# Altium schematic sheet TI_SCH.SchDoc
size 1651 x 1651 mm
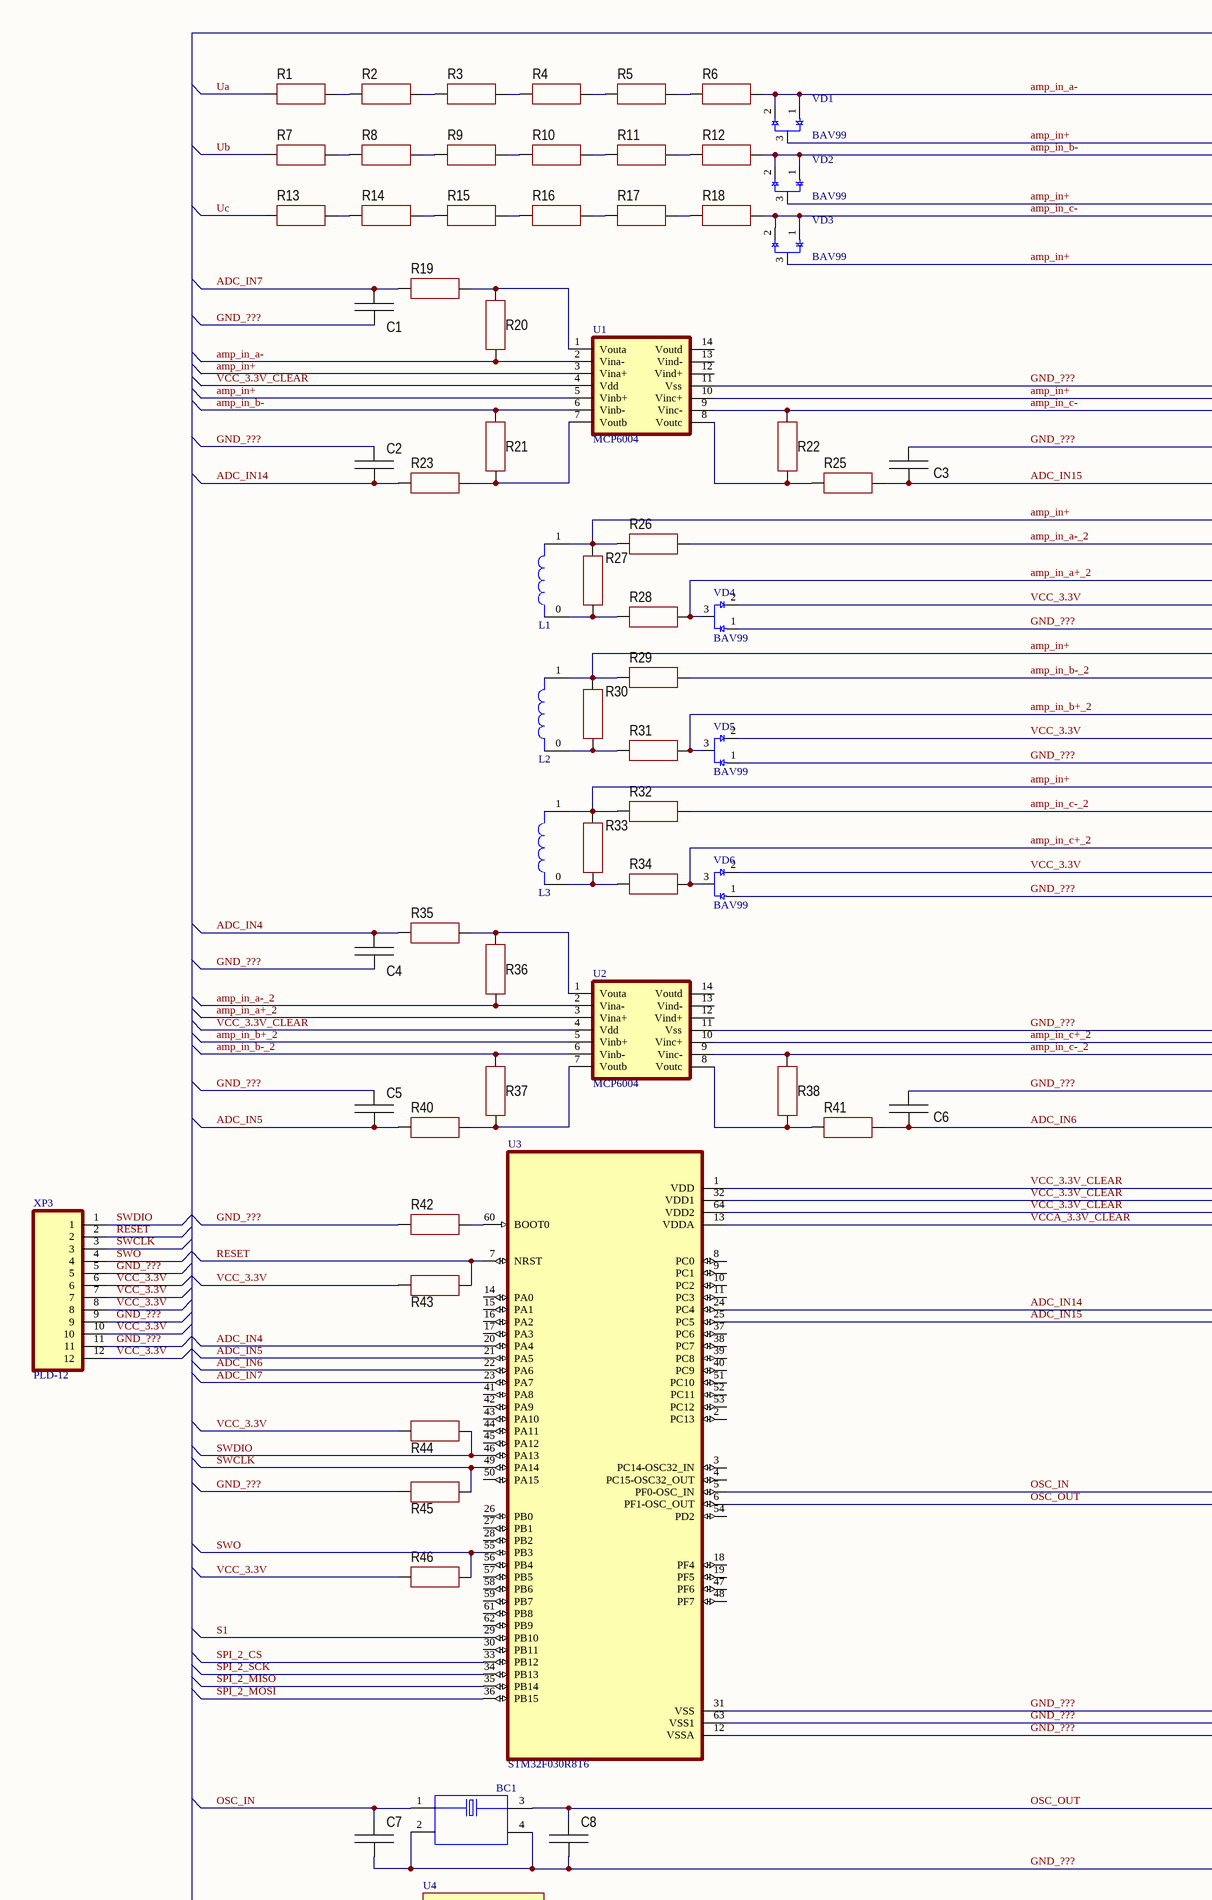
[diagram p0: TI_SCH.SchDoc, row 1 of 4 left]
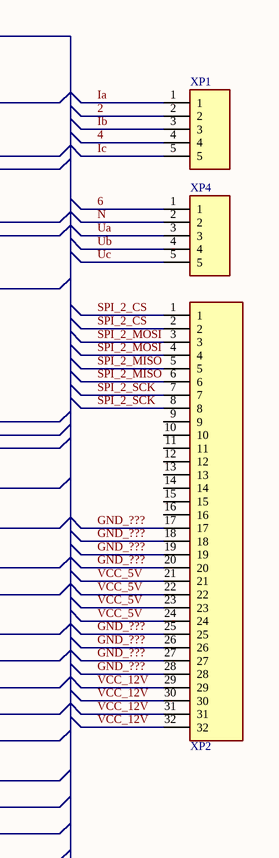
[diagram p1: TI_SCH.SchDoc, row 1 of 4 right]
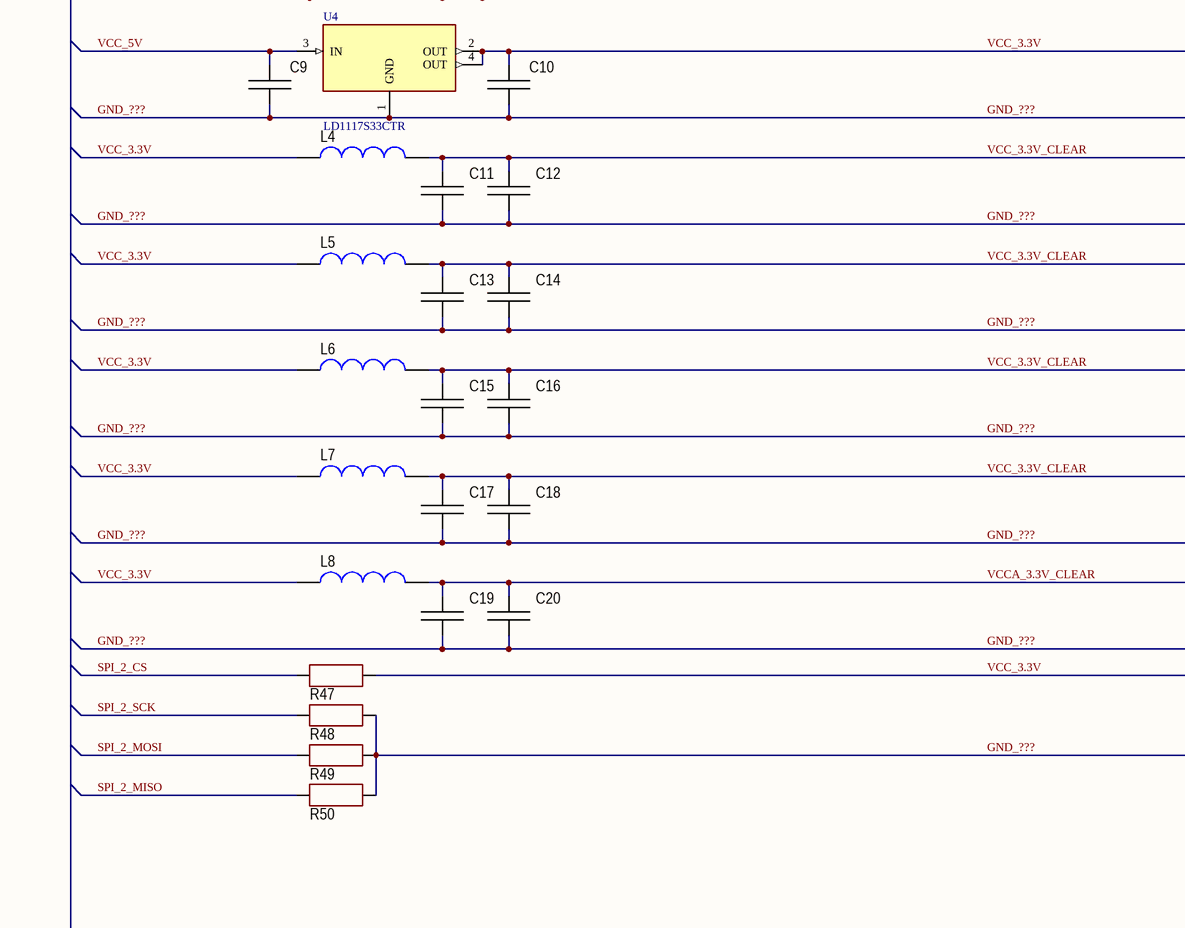
[diagram p2: TI_SCH.SchDoc, row 2 of 4 left]

## Parts
BC1  NX2520SA-24.000000MHZ-B8  [XTAL_NX2520SA-24.000000MHZ-B8]  (value not drawn)
C1  (no value)  [CAP: 0603]
C2  (no value)  [CAP: 0603]
C3  (no value)  [CAP: 0603]
C4  (no value)  [CAP: 0603]
C5  (no value)  [CAP: 0603]
C6  (no value)  [CAP: 0603]
C7  (no value)  [CAP: 0603]
C8  (no value)  [CAP: 0603]
C9  (no value)  [CAP: 2220]
C10  (no value)  [CAP: 2220]
C11  (no value)  [CAP: 0603]
C12  (no value)  [CAP: 0603]
C13  (no value)  [CAP: 0603]
C14  (no value)  [CAP: 0603]
C15  (no value)  [CAP: 0603]
C16  (no value)  [CAP: 0603]
C17  (no value)  [CAP: 0603]
C18  (no value)  [CAP: 0603]
C19  (no value)  [CAP: 0603]
C20  (no value)  [CAP: 0603]
L1  inductor  [inductor]  (value not drawn)
L2  inductor  [inductor]  (value not drawn)
L3  inductor  [inductor]  (value not drawn)
L4  (no value)  [IND: 0603]
L5  (no value)  [IND: 0603]
L6  (no value)  [IND: 0603]
L7  (no value)  [IND: 0603]
L8  (no value)  [IND: 0603]
R1  (no value)  [RES: 0603]
R2  (no value)  [RES: 0603]
R3  (no value)  [RES: 0603]
R4  (no value)  [RES: 0603]
R5  (no value)  [RES: 0603]
R6  (no value)  [RES: 0603]
R7  (no value)  [RES: 0603]
R8  (no value)  [RES: 0603]
R9  (no value)  [RES: 0603]
R10  (no value)  [RES: 0603]
R11  (no value)  [RES: 0603]
R12  (no value)  [RES: 0603]
R13  (no value)  [RES: 0603]
R14  (no value)  [RES: 0603]
R15  (no value)  [RES: 0603]
R16  (no value)  [RES: 0603]
R17  (no value)  [RES: 0603]
R18  (no value)  [RES: 0603]
R19  (no value)  [RES: 0603]
R20  (no value)  [RES: 0603]
R21  (no value)  [RES: 0603]
R22  (no value)  [RES: 0603]
R23  (no value)  [RES: 0603]
R25  (no value)  [RES: 0603]
R26  (no value)  [RES: 0603]
R27  (no value)  [RES: 0603]
R28  (no value)  [RES: 0603]
R29  (no value)  [RES: 0603]
R30  (no value)  [RES: 0603]
R31  (no value)  [RES: 0603]
R32  (no value)  [RES: 0603]
R33  (no value)  [RES: 0603]
R34  (no value)  [RES: 0603]
R35  (no value)  [RES: 0603]
R36  (no value)  [RES: 0603]
R37  (no value)  [RES: 0603]
R38  (no value)  [RES: 0603]
R40  (no value)  [RES: 0603]
R41  (no value)  [RES: 0603]
R42  (no value)  [RES: 0603]
R43  (no value)  [RES: 0603]
R44  (no value)  [RES: 0603]
R45  (no value)  [RES: 0603]
R46  (no value)  [RES: 0603]
R47  (no value)  [RES: 0603]
R48  (no value)  [RES: 0603]
R49  (no value)  [RES: 0603]
R50  (no value)  [RES: 0603]
U1  MCP6004  [MCP6004]
U2  MCP6004  [MCP6004]
U3  STM32F030R8T6  [STM32F030R8T6]
U4  LD1117S33CTR  [LD1117S33CTR]
VD1  BAV99  [BAV99]
VD2  BAV99  [BAV99]
VD3  BAV99  [BAV99]
VD4  BAV99  [BAV99]
VD5  BAV99  [BAV99]
VD6  BAV99  [BAV99]
XP1  MSTB 2.5 5-GF-5.08  [MSTB 2.5 5-GF-5.08]  (value not drawn)
XP2  DIN41612R (DS1118-32M-R23)  [DIN41612R (DS1118-32M-R23)]  (value not drawn)
XP3  PLD-12  [PLD-12]
XP4  MSTB 2.5 5-GF-5.08  [MSTB 2.5 5-GF-5.08]  (value not drawn)

## Nets
2: XP1.2
4: XP1.4
6: XP4.1
ADC_IN4: C4.1 R35.1 U3.20(PA4)
ADC_IN5: C5.1 R40.1 U3.21(PA5)
ADC_IN6: C6.1 R41.2 U3.22(PA6)
ADC_IN7: C1.1 R19.1 U3.23(PA7)
ADC_IN14: C2.1 R23.1 U3.24(PC4)
ADC_IN15: C3.1 R25.2 U3.25(PC5)
amp_in+: L1.1 L2.1 L3.1 R26.1 R27.2 R29.1 R30.2 R32.1 R33.2 U1.3(Vina+) U1.5(Vinb+) U1.10(Vinc+) VD1.3(D) VD2.3(D) VD3.3(D)
amp_in_a+_2: R28.2 U2.3(Vina+) VD4.3(D)
amp_in_a-: R6.2 R20.1 U1.2(Vina-) VD1.1(G) VD1.2(S)
amp_in_a-_2: R26.2 R36.1 U2.2(Vina-)
amp_in_b+_2: R31.2 U2.5(Vinb+) VD5.3(D)
amp_in_b-: R12.2 R21.2 U1.6(Vinb-) VD2.1(G) VD2.2(S)
amp_in_b-_2: R29.2 R37.2 U2.6(Vinb-)
amp_in_c+_2: R34.2 U2.10(Vinc+) VD6.3(D)
amp_in_c-: R18.2 R22.2 U1.9(Vinc-) VD3.1(G) VD3.2(S)
amp_in_c-_2: R32.2 R38.2 U2.9(Vinc-)
GND_???: BC1.2 BC1.4 C1.2 C2.2 C3.2 C4.2 C5.2 C6.2 C7.2 C8.2 C9.1 C10.1 C11.1 C12.1 C13.1 C14.1 C15.1 C16.1 C17.1 C18.1 C19.1 C20.1 R42.1 R45.1 R48.1 R49.1 R50.1 U1.11(Vss) U2.11(Vss) U3.12(VSSA) U3.31(VSS) U3.63(VSS1) U4.1(GND) VD4.1(G) VD5.1(G) VD6.1(G) XP2.17 XP2.18 XP2.19 XP2.20 XP2.25 XP2.26 XP2.27 XP2.28 XP3.5 XP3.9 XP3.11
Ia: XP1.1
Ib: XP1.3
Ic: XP1.5
N: XP4.2
OSC_IN: BC1.1 C7.1 U3.5(PF0-OSC_IN)
OSC_OUT: BC1.3 C8.1 U3.6(PF1-OSC_OUT)
RESET: R43.2 U3.7(NRST) XP3.2
S1: U3.29(PB10)
SPI_2_CS: R47.2 U3.33(PB12) XP2.1 XP2.2
SPI_2_MISO: R50.2 U3.35(PB14) XP2.5 XP2.6
SPI_2_MOSI: R49.2 U3.36(PB15) XP2.3 XP2.4
SPI_2_SCK: R48.2 U3.34(PB13) XP2.7 XP2.8
SWCLK: R45.2 U3.49(PA14) XP3.3
SWDIO: R44.2 U3.46(PA13) XP3.1
SWO: R46.1 U3.55(PB3) XP3.4
Ua: R1.1 XP4.3
Ub: R7.1 XP4.4
Uc: R13.1 XP4.5
VCC_3.3V: C10.2 L4.2 L5.2 L6.2 L7.2 L8.2 R43.1 R44.1 R46.2 R47.1 U4.2(OUT) U4.4(OUT) VD4.2(S) VD5.2(S) VD6.2(S) XP3.6 XP3.7 XP3.8 XP3.10 XP3.12
VCC_3.3V_CLEAR: C11.2 C12.2 C13.2 C14.2 C15.2 C16.2 C17.2 C18.2 L4.1 L5.1 L6.1 L7.1 U1.4(Vdd) U2.4(Vdd) U3.1(VDD) U3.32(VDD1) U3.64(VDD2)
VCC_5V: C9.2 U4.3(IN) XP2.21 XP2.22 XP2.23 XP2.24
VCC_12V: XP2.29 XP2.30 XP2.31 XP2.32
VCCA_3.3V_CLEAR: C19.2 C20.2 L8.1 U3.13(VDDA)
NetL1_0: L1.0 R27.1 R28.1
NetL2_0: L2.0 R30.1 R31.1
NetL3_0: L3.0 R33.1 R34.1
NetR1_2: R1.2 R2.1
NetR2_2: R2.2 R3.1
NetR3_2: R3.2 R4.1
NetR4_2: R4.2 R5.1
NetR5_2: R5.2 R6.1
NetR7_2: R7.2 R8.1
NetR8_2: R8.2 R9.1
NetR9_2: R9.2 R10.1
NetR10_2: R10.2 R11.1
NetR11_2: R11.2 R12.1
NetR13_2: R13.2 R14.1
NetR14_2: R14.2 R15.1
NetR15_2: R15.2 R16.1
NetR16_2: R16.2 R17.1
NetR17_2: R17.2 R18.1
NetR19_2: R19.2 R20.2 U1.1(Vouta)
NetR21_1: R21.1 R23.2 U1.7(Voutb)
NetR22_1: R22.1 R25.1 U1.8(Voutc)
NetR35_2: R35.2 R36.2 U2.1(Vouta)
NetR37_1: R37.1 R40.2 U2.7(Voutb)
NetR38_1: R38.1 R41.1 U2.8(Voutc)
NetR42_2: R42.2 U3.60(BOOT0)

Not connected (* = marked no-connect by the designer): U1 12(Vind+) 13(Vind-) 14(Voutd); U2 12(Vind+) 13(Vind-) 14(Voutd); U3 2(PC13) 3(PC14-OSC32_IN) 4(PC15-OSC32_OUT) 8(PC0) 9(PC1) 10(PC2) 11(PC3) 14(PA0) 15(PA1) 16(PA2) 17(PA3) 18(PF4) 19(PF5) 26(PB0) 27(PB1) 28(PB2) 30(PB11) 37(PC6) 38(PC7) 39(PC8) 40(PC9) 41(PA8) 42(PA9) 43(PA10) 44(PA11) 45(PA12) 47(PF6) 48(PF7) 50(PA15) 51(PC10) 52(PC11) 53(PC12) 54(PD2) 56(PB4) 57(PB5) 58(PB6) 59(PB7) 61(PB8) 62(PB9); XP2 9 10 11 12 13 14 15 16

## Library data of the parts
BC1 = NX2520SA-24.000000MHZ-B8: 24MHz Â±10ppm Crystal 10pF 100 Ohms 4-SMD, No Lead; Value: R2520-32.000-8-F-1030-EXT-TR; Help URL: https://www.digikey.com/en/products/detail/raltron-electronics/R2520-32-000-8-F-1030-EXT-TR/10272594?s=N4IgTCBcDaIEpgKxgAwFoDMYB0K9oA40AxNARhQ3QFEANAFTXrhAF0BfIA; Mount: SMD-4; Name: Crystal
C1-C6 = Ceramic_0603: Name: Capacitor; Value: 0.047mF; HelpURL: https://www.chipdip.by/product/grm188r71e473k; Mount: 0603
C7 C8 = Ceramic_0603: Name: Capacitor; Value: 22pF, 25V, X7R; Help URL: https://ru.mouser.com/ProductDetail/KEMET/C0603C220K3RACTU?qs=sGAEpiMZZMsh%252B1woXyUXj6Gmda51bNDiU8Rysq%2Fu3cg%3D; Mount: 0603
C9 C10 = Ceramic_2220: Name: Capacitor; Value: 10uF, 25V, X7R; Help URL: https://ru.mouser.com/ProductDetail/KEMET/C2220C106K3RACTU?qs=AiEy7T%252BpANdh8MDp0HivKw%3D%3D; Mount: 2220
C11 C17 = Ceramic_0603: Name: Capacitor; Value: 4.7uF, 25V, X5R; Help URL: https://www.chipdip.by/product0/9000348448; Mount: 0603
C12 C18 = Ceramic_0603: Name: Capacitor; Value: 0.1uF, 16V, X7R; Help URL: https://www.chipdip.by/product0/9000591947; Mount: 0603
C13 C15 C19 = Ceramic_0603: Name: Capacitor; Value: 1uF, 25V, X7R; Help URL: https://www.chipdip.by/product/grm188r71e105ka12d; Mount: 0603
C14 C16 C20 = Ceramic_0603: Name: Capacitor; Value: 0.01uF, 50V, X7R; Help URL: https://www.chipdip.by/product/grm188r71h103k; Mount: 0603
L4-L8 = Inductor_0603: Name: Ferrite bead; Value: BLM18PG121SN1D; Help URL: https://www.digikey.com/en/products/detail/murata-electronics/BLM18PG121SN1D/584248?s=N4IgTCBcDaIEIBkCyBGAHABQOIrCgygHIoAiIAugL5A; Mount: 0603
R1-R4 R7-R10 R13-R16 = Resistor_0603: Value: 158K; Mount: 0603; Name: Resistor
R5 R6 R11 R12 R17 R18 = Resistor_0603: Value: 63.4K; Mount: 0603; Name: Resistor
R19 R23 R25 R35 R40 R41 = Resistor_0603: Value: 100; Mount: 0603; Name: Resistor
R20-R22 = Resistor_0603: Value: 2.49K; Mount: 0603; Name: Resistor
R26 R29 R32 = Resistor_0603: Value: 7.87K; Mount: 0603; Name: Resistor
R27 R30 R33 = Resistor_0603: Value: 15; Mount: 0603; Name: Resistor
R28 R31 R34 = Resistor_0603: Value: 330; Mount: 0603; Name: Resistor
R36-R38 = Resistor_0603: Value: 60.4K; Mount: 0603; Name: Resistor
R42 = Resistor_0603: Value: 100K; Help URL: https://www.chipdip.by/product0/9000079760; Mount: 0603; Name: Resistor
R43-R50 = Resistor_0603: Value: 10K; Help URL: https://www.chipdip.by/product0/9000079736; Mount: 0603; Name: Resistor
U1 U2 = MCP6004: Name: Operational amplifier; Mount: SOIC-14; Value: MCP6004; Help URL: https://www.chipdip.by/product/mcp6004-i-sl
U3 = STM32F030R8T6: Name: Microcontroller; Value: STM32F030R8T6; Help URL: https://www.chipdip.by/product/stm32f030r8t6-2; Mount: LQFP-64
U4 = LD1117S33CTR: Linear Voltage Regulator IC 1 Output 800mA SOT-223; Mount: SOT-223; Help URL: https://www.chipdip.by/product/ld1117s33ctr-2; Value: LD1117S33CTR; Name: Regulator
VD1-VD6 = BAV99: Name: diode; Mount: SOT-23-3; Help URL: https://www.chipdip.by/product/bav99-nxp; Value: BAV99
XP1 XP4 = MSTB 2,5 5-GF-5,08: Name: Connector; Value: MSTB 2.5 5-GF-5.08; Help URL: https://www.phoenixcontact.com/online/portal/ru/?uri=pxc-oc-itemdetail:pid=1776537&library=ruru&pcck=P-11-02-11&tab=1&selectedCategory=ALL
XP2 = DIN41612R (DS1118-32M-R23): Name: Connector; Help URL: https://www.chipdip.by/product/din41612r-ds1118-32m-r23; Value: DIN41612R (DS1118-32M-R23)
XP3 = PLD-12: Name: Connector; Value: PLD-12; Help URL: https://erk.by/product/1032227/
L1-L3 = inductor: Name: Inductor